# Altium schematic sheet Connector.SchDoc
size A4
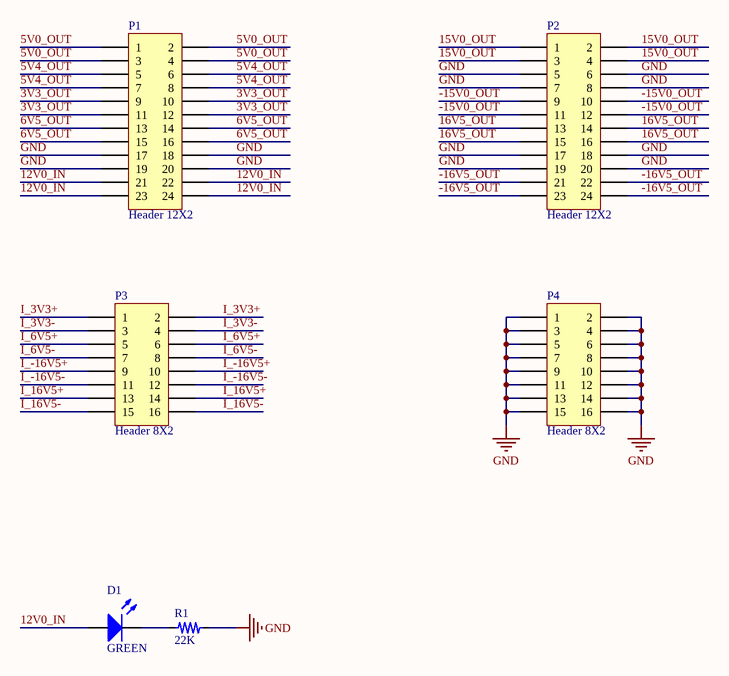
[diagram p0: Connector.SchDoc]

## Parts
D1  value GREEN  [LED0603]  (hidden comment: LED)
P1  Header 12X2  [HDR2X12]
P2  Header 12X2  [HDR2X12]
P3  Header 8X2  [HDR2X8]
P4  Header 8X2  [HDR2X8]
R1  value 22K  [R0603]  (hidden comment: Res)

## Nets
GND: P1.17 P1.18 P1.19 P1.20 P2.5 P2.6 P2.7 P2.8 P2.17 P2.18 P2.19 P2.20 P4.1 P4.2 P4.3 P4.4 P4.5 P4.6 P4.7 P4.8 P4.9 P4.10 P4.11 P4.12 P4.13 P4.14 P4.15 P4.16 R1.1
3V3_OUT: P1.9 P1.10 P1.11 P1.12
5V0_OUT: P1.1 P1.2 P1.3 P1.4
5V4_OUT: P1.5 P1.6 P1.7 P1.8
6V5_OUT: P1.13 P1.14 P1.15 P1.16
12V0_IN: D1.1(A) P1.21 P1.22 P1.23 P1.24
15V0_OUT: P2.1 P2.2 P2.3 P2.4
16V5_OUT: P2.13 P2.14 P2.15 P2.16
-15V0_OUT: P2.9 P2.10 P2.11 P2.12
-16V5_OUT: P2.21 P2.22 P2.23 P2.24
I_3V3+: P3.1 P3.2
I_3V3-: P3.3 P3.4
I_6V5+: P3.5 P3.6
I_6V5-: P3.7 P3.8
I_16V5+: P3.13 P3.14
I_16V5-: P3.15 P3.16
I_-16V5+: P3.9 P3.10
I_-16V5-: P3.11 P3.12
NetD1_2: D1.2(K) R1.2

## Library data of the parts
P1 P2 = Header 12X2: Header, 12-Pin, Dual row
P3 P4 = Header 8X2: Header, 8-Pin, Dual row
R1 = Res: 电阻